# Altium schematic sheet IMU_MPU-9250.SchDoc
size A3; Author: Group 19; Address1: ECE Department; Address2: University of Canterbury; Address3: Christchurch 8041; Address4: New Zealand; Revision: 1
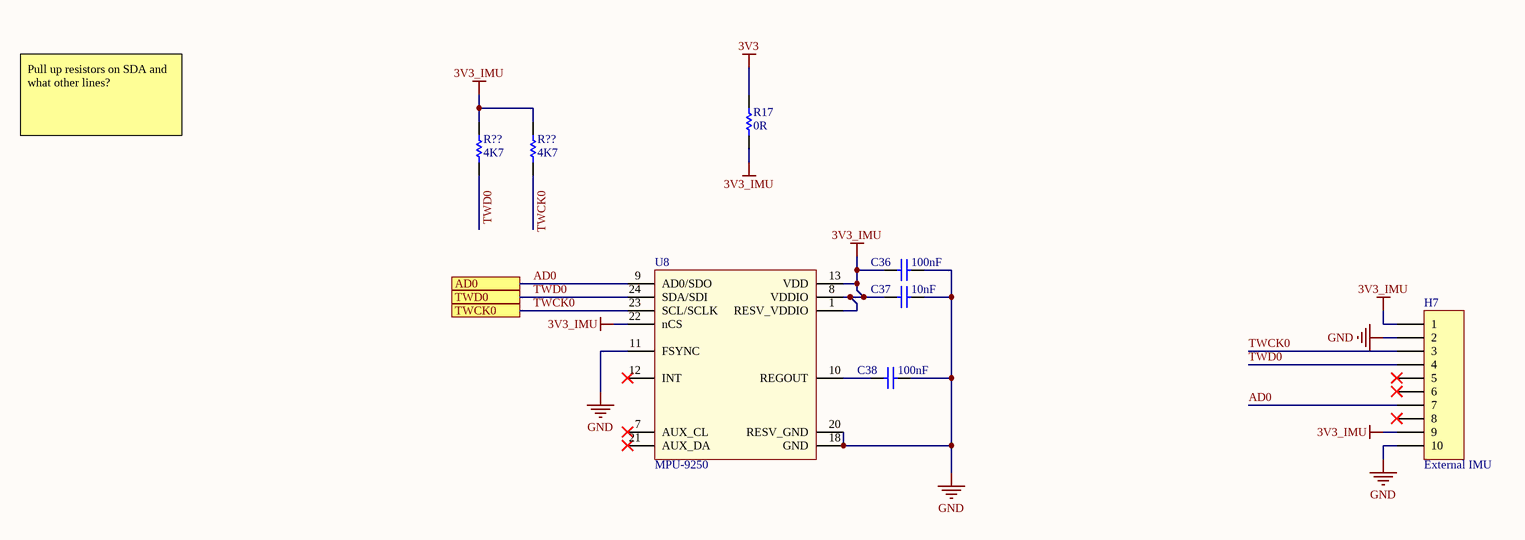
[diagram p0: IMU_MPU-9250.SchDoc]

## Parts
(Parts that share a designator on the sheet are numbered #1, #2 ... from top to bottom, then left to right.)
C36  100nF  [CAPC1608L]
C37  10nF  [CAPC1608L]
C38  100nF  [CAPC1608L]
H7  External IMU  [MOLEX_KK_10_HDR]
R17  0R  [RESC1608L]
R??#1  4K7  [RESC1608L]
R??#2  4K7  [RESC1608L]
U8  MPU-9250  [Quad24]

## Ports
AD0, TWCK0, TWD0

## Nets
3V3: R17.2
3V3_IMU: C36.1 C37.1 H7.1 H7.9 R17.1 R??#1.2 R??#2.2 U8.1(RESV_VDDIO) U8.8(VDDIO) U8.13(VDD) U8.22(nCS)
GND: C36.2 C37.2 C38.1 H7.2 H7.10 U8.11(FSYNC) U8.18(GND) U8.20(RESV_GND)
AD0: H7.7 U8.9(AD0/SDO) ; port AD0
TWCK0: H7.3 R??#2.1 U8.23(SCL/SCLK) ; port TWCK0
TWD0: H7.4 R??#1.1 U8.24(SDA/SDI) ; port TWD0
NetC38_2: C38.2 U8.10(REGOUT)

Not connected (* = marked no-connect by the designer): H7 5* 6* 8*; U8 7(AUX_CL)* 12(INT)* 21(AUX_DA)*

## Notes on the sheet
- Pull up resistors on SDA and what other lines?
- Title
- Drawn by:
- Date:
- Time:
- Revision:
- Sheet
- of
- File:

## Library data of the parts
C36 C38 = CC_100nF_0603: CAP CER 100nF X7R +-10% 50V 0603; PackageReference: 0603; Code_IPC: 1608 [0603]; Verify: *; Supplier: ECE Dept; Storage Location: PCB Assembly WS; Value: 100nF
C37 = CC_10nF_0603: CAP CER 10nF X7R +-10% 50V 0603; PackageReference: 0603; Code_IPC: 1608 [0603]; Verify: *; Supplier: ECE Dept; Storage Location: PCB Assembly WS; Value: 10nF
H7 = JA_MOLEX_KK_10POS: CONN HEADER 10POS 2.54mm VERT_ Thru Hole; Supplier 1: Farnell; Supplier Part Number 1: 1756828; Supplier: ECE Dept; Storage Location: ECE Dept Store; Value: External IMU
R17 = RS_0R0: RES 0.0 OHM 1/10W 5% 0603 SMD; Storage Location: PCB Assembly WS; Supplier: ECE Dept; Value: 0R
R??#1 R??#2 = RS_4K7: RES 4.7K OHM 1/10W 5% 0603 SMD; Storage Location: PCB Assembly WS; Supplier: ECE Dept; Value: 4K7
U8 = MPU-9250: 9 axis IMU